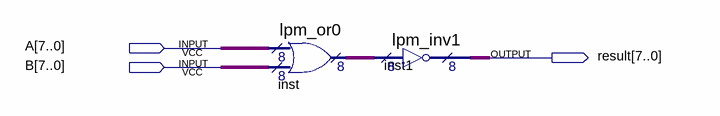
[diagram p0: schematic sheet]
// Quartus schematic ALU_nor.bdf as structural Verilog: 2 symbols, 3 pins
module ALU_nor (
  input  [7:0] A,
  input  [7:0] B,
  output [7:0] result
);

  wire [7:0] inst_result;

  lpm_or0 inst (.data0x(A), .data1x(B), .result(inst_result));
  lpm_inv1 inst1 (.data(inst_result), .result(result));
endmodule
